# EAGLE design LED Mirror 555 (EAGLE 7.4.0)
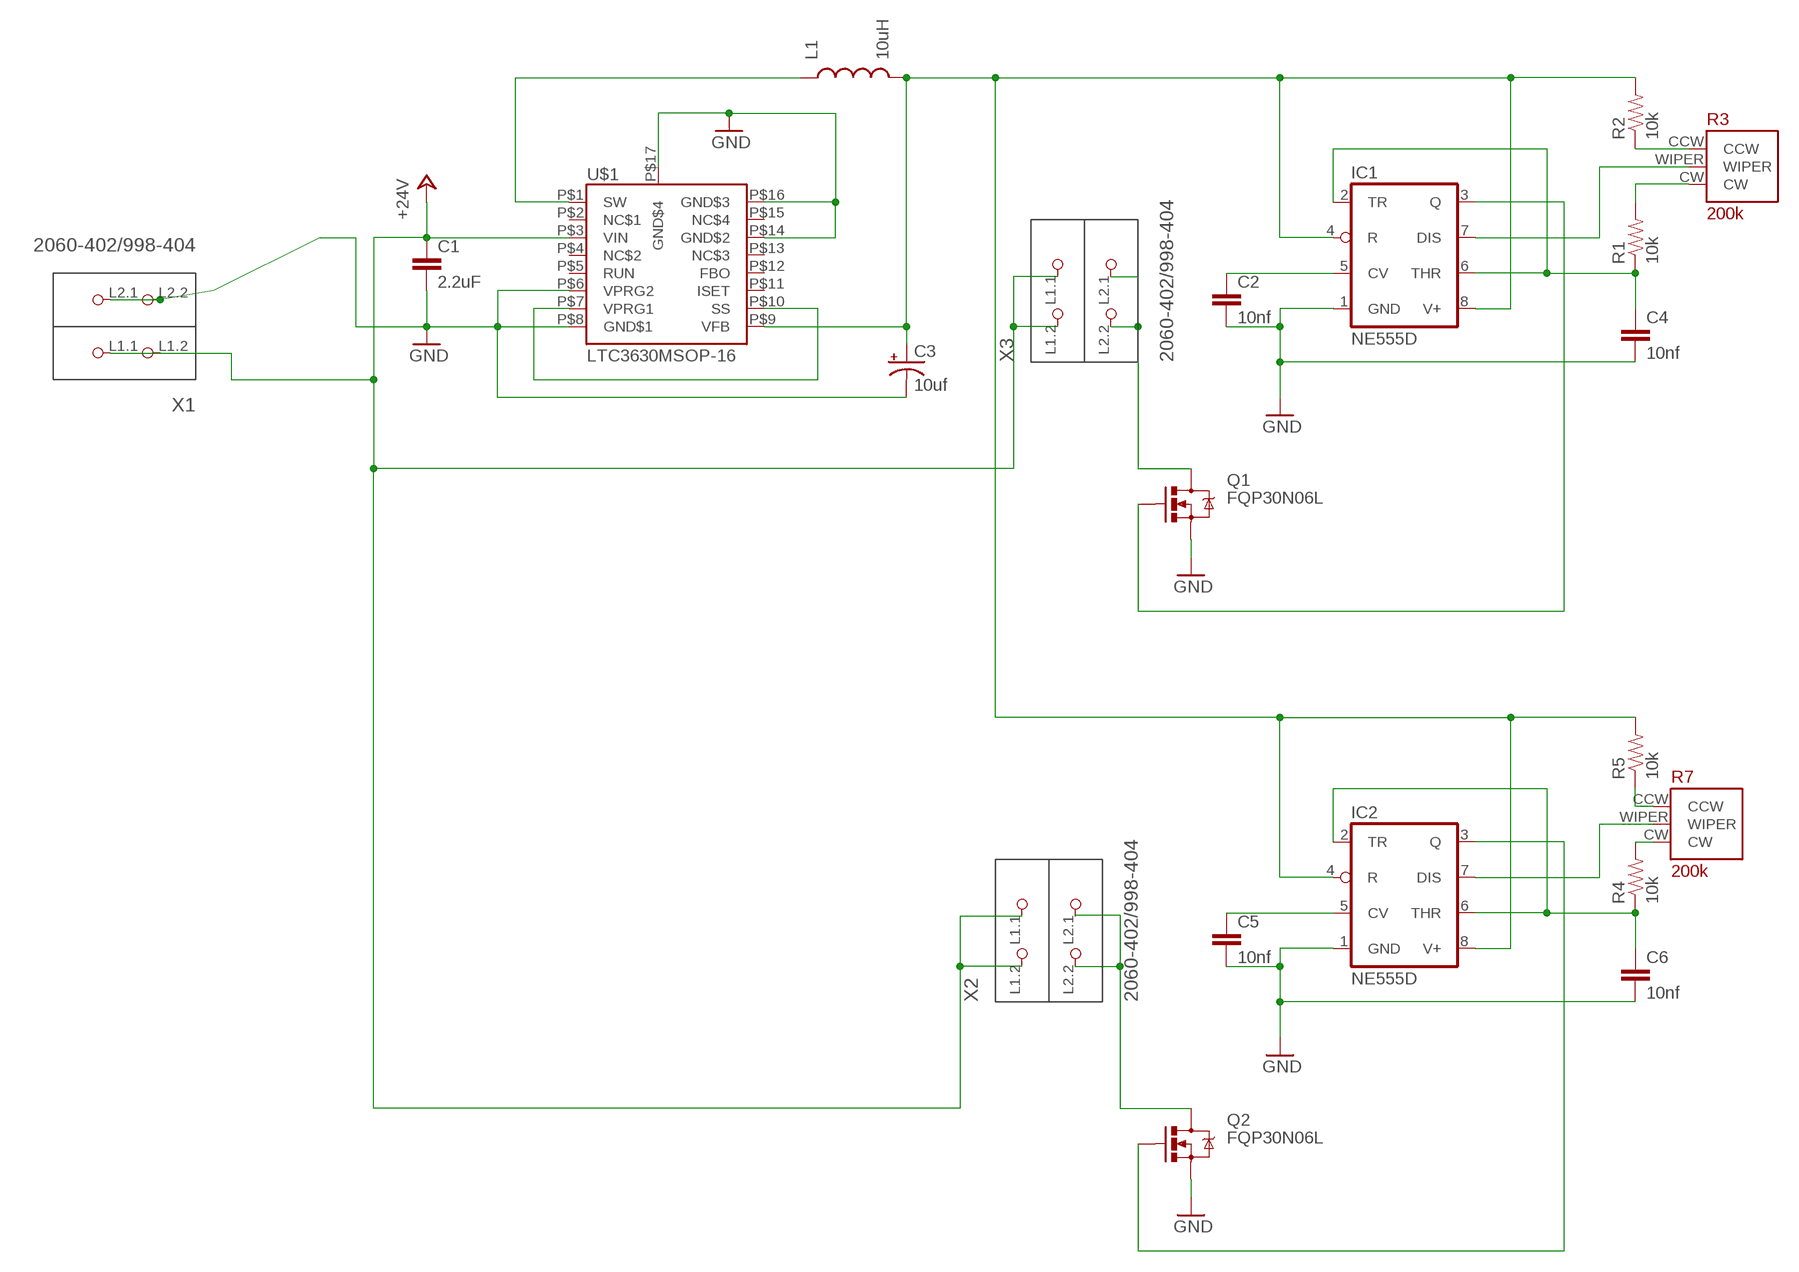
[diagram p0: schematic, sheet 1]

## Parts
C1  2.2uF  CAP0805  [0805]
C2  10nf  CAP0805  [0805]
C3  10uf  CAP_POL1206  [EIA3216]
C4  10nf  CAP0805  [0805]
C5  10nf  CAP0805  [0805]
C6  10nf  CAP0805  [0805]
IC1  NE555D  [SO08]
IC2  NE555D  [SO08]
L1  10uH  INDUCTORNPI75  [NPI75C]
Q1  FQP30N06L  MOSFET-NCHANNELFQP30N06L  [TO220V]
Q2  FQP30N06L  MOSFET-NCHANNELFQP30N06L  [TO220V]
R1  10k  RESISTOR0805-RES  [0805]
R2  10k  RESISTOR0805-RES  [0805]
R3  200k  TRIMPOT_3296W_SMD  [TRIMPOT_3296_SMD]
R4  10k  RESISTOR0805-RES  [0805]
R5  10k  RESISTOR0805-RES  [0805]
R7  200k  TRIMPOT_3296W_SMD  [TRIMPOT_3296_SMD]
U$1  LTC3630MSOP-16  [MSOP-16]
X1  2060-402/998-404  [P-2060-402/998-404]
X2  2060-402/998-404  [P-2060-402/998-404]
X3  2060-402/998-404  [P-2060-402/998-404]

## Nets
+24V: C1.1 U$1.P$3(VIN) X1.L1.1(P1.1) X1.L1.2(P1.2) X2.L1.1(P1.1) X2.L1.2(P1.2) X3.L1.1(P1.1) X3.L1.2(P1.2)
GND: C1.2 C2.2 C3.C(-) C4.2 C5.2 C6.2 IC1.1(GND) IC2.1(GND) Q1.3(S) Q2.3(S) U$1.P$6(VPRG2) U$1.P$8(GND$1) U$1.P$14(GND$2) U$1.P$16(GND$3) U$1.P$17(GND$4) X1.L2.1(P2.1) X1.L2.2(P2.2)
N$1: U$1.P$7(VPRG1) U$1.P$10(SS)
N$2: L1.1 U$1.P$1(SW)
N$3: C3.A(+) IC1.4(R) IC1.8(V+) IC2.4(R) IC2.8(V+) L1.2 R2.2 R5.2 U$1.P$9(VFB)
N$4: IC1.3(Q) Q1.1(G)
N$5: Q1.2(D) X3.L2.1(P2.1) X3.L2.2(P2.2)
N$6: R2.1 R3.CCW
N$7: R1.2 R3.CW
N$8: C2.1 IC1.5(CV)
N$9: IC1.7(DIS) R3.WIPER
N$10: C4.1 IC1.2(TR) IC1.6(THR) R1.1
N$11: R4.2 R7.CW
N$12: Q2.2(D) X2.L2.2(P2.2)
N$13: IC2.3(Q) Q2.1(G)
N$14: C5.1 IC2.5(CV)
N$15: C6.1 IC2.2(TR) IC2.6(THR) R4.1
N$16: R5.1 R7.CCW
N$18: IC2.7(DIS) R7.WIPER
Unconnected: U$1.P$2(NC$1) U$1.P$4(NC$2) U$1.P$5(RUN) U$1.P$11(ISET) U$1.P$12(FBO) U$1.P$13(NC$3) U$1.P$15(NC$4) X2.L2.1(P2.1)

## Library data of the parts
C1 C2 C4-C6 = SparkFun-Capacitors:CAP: Capacitor Standard 0603 ceramic capacitor, and 0.1" leaded capacitor.
C3 = SparkFun-Capacitors:CAP_POL: Capacitor Polarized These are standard SMD and PTH capacitors. Normally 10uF, 47uF, and 100uF in electrolytic and tantalum varieties. Always verify the external diameter of the through hole cap, it varies with capacity, voltage, and manufacturer. The EIA devices should be standard.
IC1 IC2 = adafruit:*555: TIMER Changed DIP package to have round (not oval) pin pads http://www.ladyada.net/library/pcb/eaglelibrary.html
L1 = SparkFun-Passives:INDUCTOR: Inductors Basic Inductor/Choke - 0603 and 1206. Footprints are not proven and vary greatly between part numbers. INDUCTOR POWER 3.3UH 4.0A SMD 0.197" L x 0.197" W x 0.177" H (5.00mm x 5.00mm x 4.50mm)
Q1 Q2 = SparkFun-DiscreteSemi:MOSFET-NCHANNEL: Common NMOSFET Parts MFG P/N Store ID Prod ID FDD8780 TRANS-09984 SI7820DN TRANS-11055 FDS6630A IC-08089 2N7002PW TRANS-11151 FQP30N06L COM-10213 TRANS-10060 BSS123LT1G TRANS-08345 BSS138 TRANS-00830 BS170 2N7000; PROD_ID: TRANS-10060
R1 R2 R4 R5 = SparkFun-Passives:RESISTOR: Resistor Basic schematic elements and footprints for 0603, 1206, and PTH resistors.
R3 R7 = eagle-library:TRIMPOT_3296W_SMD
U$1 = eagle-library:LTC3630
X1-X3 = con-wago_2060:2060-402/998-404: Serie 2060, SMD-Leiterplattenklemme mit Betätigungsdrückern im Gurt 2-polig / Series 2060, SMD terminal block with push-buttons in tape-and-reel packing 2-pole Polzahl / Pole No.: 2 Rastermaß / Pitch: 4 mm Bemessungsspannung / Rated Voltage: 160 V Nennstrom / Nominal Current: 9 A Leiterquerschnitt / Conductor Size: 0.2 - 0.75 mm2 Anschlusstechnik / Connection Technology: CAGE CLAMP® S Leitereinführung (zur Platine) / Conductor entry angle (to PCB): 0 ° Farbe / Color: lichtgrau / light gray Stand: 01.01.2014. Die jeweils aktuellen Daten zu diesem Artikel finden Sie in unserem Produktkatalog, den Sie unter www.wago.com einsehen können. As of: 01/01/2014. Please find the newest data for this article in our product catalogue, which can be viewed under www.wago.com.

## Net classes
1 PWR: width 0.61 mm

## Board
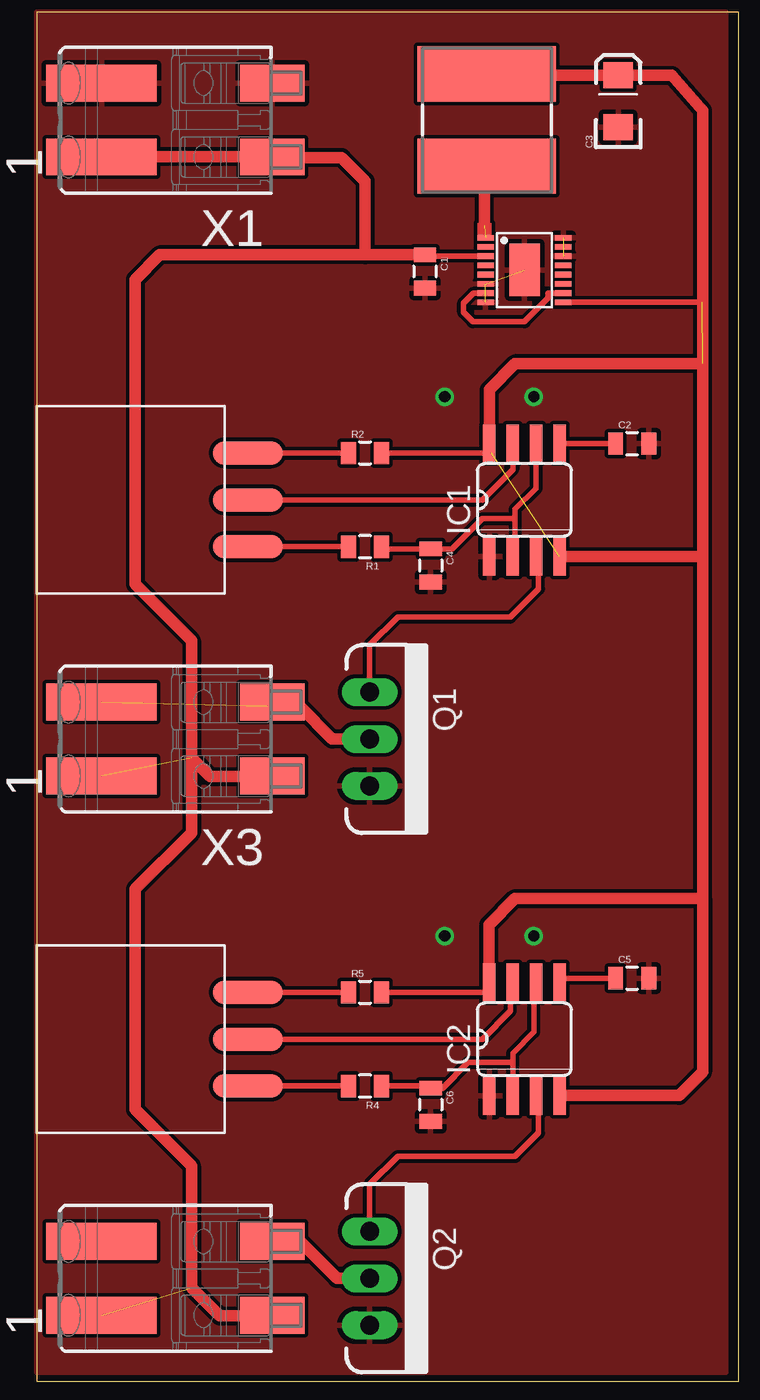
[diagram p1: board, top side]
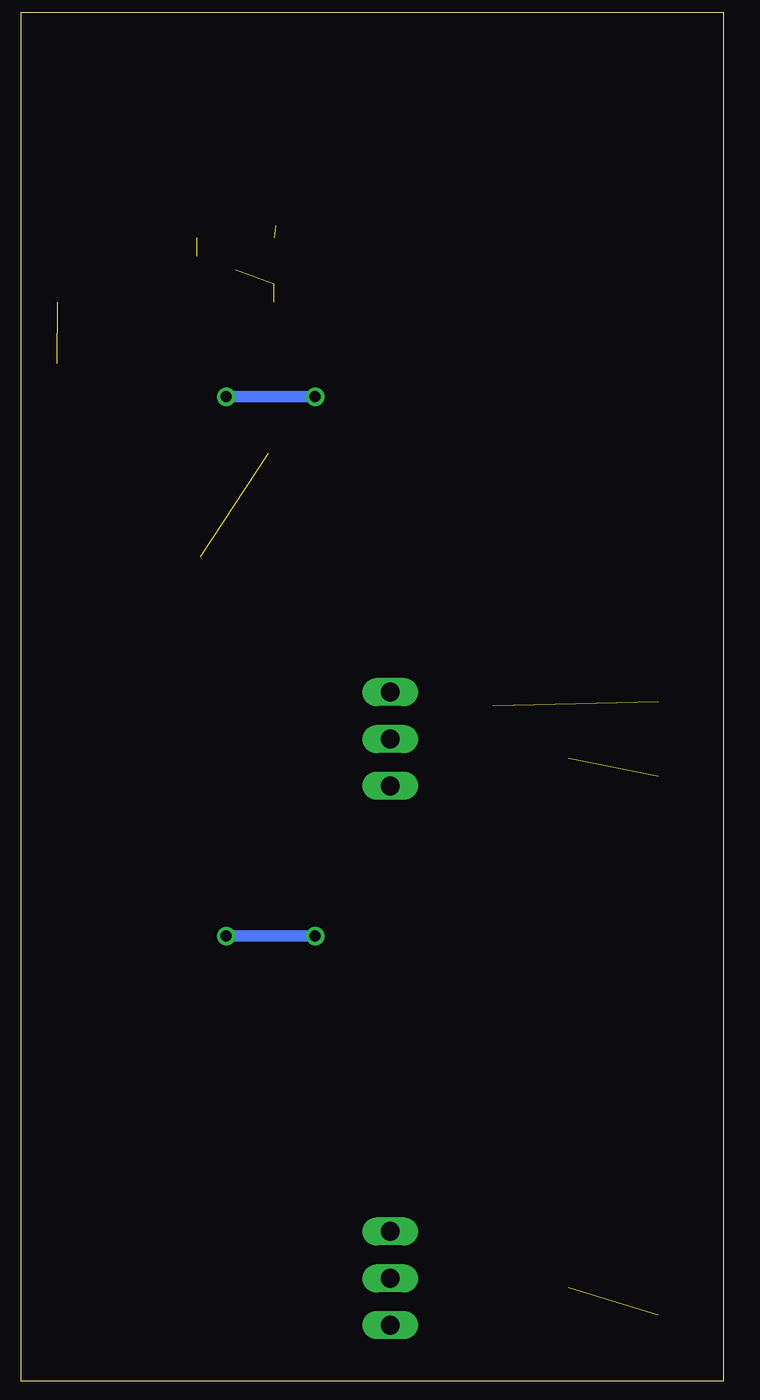
[diagram p2: board, bottom side, seen from below]

No outline drawn. Coordinates in mm, seen from the top.
Copper layers (1*16): Top 0.035mm / dielectric 1.5mm / Bottom 0.035mm
Design rules "default *": minimum track width 10mil, minimum drill 24mil, track to track 8mil, track to pad 8mil, pad to pad 8mil, via to via 8mil, smd to smd 8mil, copper to edge 40mil, drill to drill 8mil, minimum pad ring 10mil, minimum via ring 8mil, stop-mask expansion 4mil, vias tented up to drill 0mil, thermal gap 10mil
Milling: 4 lines

### Footprints (pad centres in the part's own frame; a part is rotated, then mirrored left to right if it is on the bottom)
0805 = smd 0.8 x 1.2: 1 -0.9,0; 2 0.9,0
EIA3216 = smd 1.4 x 1.6: A 1.4,0; C -1.4,0
SO08 = smd 0.66 x 2.032: 1 -1.905,-3.073; 2 -0.635,-3.073; 3 0.635,-3.073; 4 1.905,-3.073; 5 1.905,3.073; 6 0.635,3.073; 7 -0.635,3.073; 8 -1.905,3.073
NPI75C = smd 3 x 7.5: 1 -2.5,0; 2 2.5,0
TO220V = drill 1.016 long: 1 -2.54,0; 2 0,0; 3 2.54,0
TRIMPOT_3296_SMD = smd 1.27 x 3.81: CCW -2.54,6.35; CW 2.54,6.35; WIPER 0,6.35
MSOP-16 = smd 0.305 x 0.889: P$1 -1.75,-2.1; P$2 -1.25,-2.1; P$3 -0.75,-2.1; P$4 -0.25,-2.1; P$5 0.25,-2.1; P$6 0.75,-2.1; P$7 1.25,-2.1; P$8 1.75,-2.1; P$9 1.75,2.1; P$10 1.25,2.1; P$11 0.75,2.1; P$12 0.25,2.1; P$13 -0.25,2.1; P$14 -0.75,2.1; P$15 -1.25,2.1; P$16 -1.75,2.1 | smd 2.845 x 1.651: P$17 0,0
P-2060-402/998-404 = smd 6 x 2: L1.1 4.625,2; L2.1 4.625,-2 | smd 3.5 x 2: L1.2 -4.625,2; L2.2 -4.625,-2

### Placement (x,y rotation side)
C1  21.03,60.12 270 top
C2  32.26,50.8 0 top
C3  31.5,69.34 90 top
C4  21.34,44.2 270 top
C5  32.26,21.84 0 top
C6  21.34,14.99 270 top
IC1  26.42,47.75 0 top
IC2  26.42,18.54 0 top
L1  24.38,68.33 90 top
Q1  18.03,34.8 270 top
Q2  18.03,5.59 270 top
R1  17.78,45.21 180 top
R2  17.78,50.29 0 top
R3  5.08,47.75 270 top
R4  17.78,16 180 top
R5  17.78,21.08 0 top
R7  5.08,18.54 270 top
U$1  26.42,60.2 270 top
X1  8.13,68.33 180 top
X2  8.13,5.59 180 top
X3  8.13,34.8 180 top

### Tracks (layer width: path | path; a pad name or v marks a point on that pad's centre or on a via)
+24V  (2 unrouted)
  Top 0.305: U$1.P$3 21.03,60.95 C1.1
  Top 0.61: X1.L1.1 X1.L1.2 12.28,66.29 16.51,66.29 17.78,65.02 17.78,61.02 | C1.1 17.78,61.02 | 17.78,61.02 6.67,61.02 5.33,59.69 5.33,43.18 8.38,40.13 8.38,33.78 | 8.38,33.78 9.4,32.77 12.21,32.77 X3.L1.2 | 8.38,33.78 8.38,29.72 5.33,26.67 5.33,14.73 8.38,11.68 8.38,5.08 9.91,3.56 11.68,3.56 | 11.68,3.56 12.21,3.56 X2.L1.2 | 11.65,3.59 11.68,3.56
GND  (via drill 0.6)  (3 unrouted)
  Bottom 0.61: v26.92,24.13 v22.1,24.13 | v26.92,53.34 v22.1,53.34
  pour Top (rank 6): 0,0.51 37.34,0.51 37.34,74.17 0,74.17
N$1
  Top 0.305: U$1.P$7 23.64,58.95 23.11,58.42 23.11,57.91 23.62,57.4 26.42,57.4 27.69,58.67 27.69,58.93 27.71,58.95 U$1.P$10
N$2  (1 unrouted)
  Top 0.61: 24.46,65.71 L1.1 24.93,65.79 26.67,65.79 24.26,66.17 24.26,62.61
N$3  (2 unrouted)
  Top 0.305: U$1.P$9 36.04,58.45 | R2.2 24.64,50.29 24.64,50.7 IC1.8 | R5.2 24.64,21.08 24.64,21.49 IC2.8
  Top 0.61: L1.2 24.98,70.74 C3.A 34.41,70.74 36.07,68.83 36.07,55.12 | 34.57,44.68 IC1.4 36.04,44.68 | IC2.8 24.49,21.59 24.49,24.74 25.91,26.16 36.07,26.16 | 36.07,26.16 36.07,16.76 34.8,15.49 28.35,15.49 IC2.4 | IC1.8 24.51,53.72 25.91,55.12 36.07,55.12 | 36.07,26.16 36.07,55.12
N$4
  Top 0.305: Q1.1 18.03,39.88 19.56,41.4 25.65,41.4 27.18,42.93 27.18,44.55 IC1.3
N$5  (1 unrouted)
  Top 0.61: Q1.2 16,34.8 14.22,36.58 12.47,36.58 X3.L2.2
N$6
  Top 0.305: R3.CCW R2.1
N$7
  Top 0.305: R3.CW R1.2
N$8
  Top 0.305: C2.1 28.35,50.8 IC1.5
N$9
  Top 0.305: IC1.7 25.78,49.4 24.13,47.75 R3.WIPER
N$10
  Top 0.305: IC1.6 27.04,51.6 27.04,48.38 25.91,47.24 25.91,46.74 | 25.91,46.74 25.91,45.57 IC1.2 | R1.1 18.8,45.1 C4.1 22.49,45.1 24.13,46.74 25.91,46.74
N$11
  Top 0.305: R7.CW R4.2
N$12
  Top 0.61: Q2.2 16.26,5.59 14.22,7.62 12.28,7.62 X2.L2.2
N$13
  Top 0.305: 26.92,15.34 IC2.3 27.18,15.34 27.18,13.46 25.91,12.19 19.56,12.19 18.03,10.67 Q2.1
N$14
  Top 0.305: C5.1 28.55,21.84 IC2.5
N$15
  Top 0.305: IC2.2 25.78,17.27 | 25.78,17.27 25.78,17.78 26.92,18.92 26.92,21.49 IC2.6 | R4.1 20.97,16 C6.1 21.98,15.89 23.37,17.27 25.78,17.27
N$16
  Top 0.305: R7.CCW R5.1
N$18
  Top 0.305: IC2.7 25.65,21.49 25.65,20.07 24.13,18.54 R7.WIPER
(copper drawn outside any net)
  shapes: Top area x1